# EAGLE design operator-interface-r1 (EAGLE 5.12)
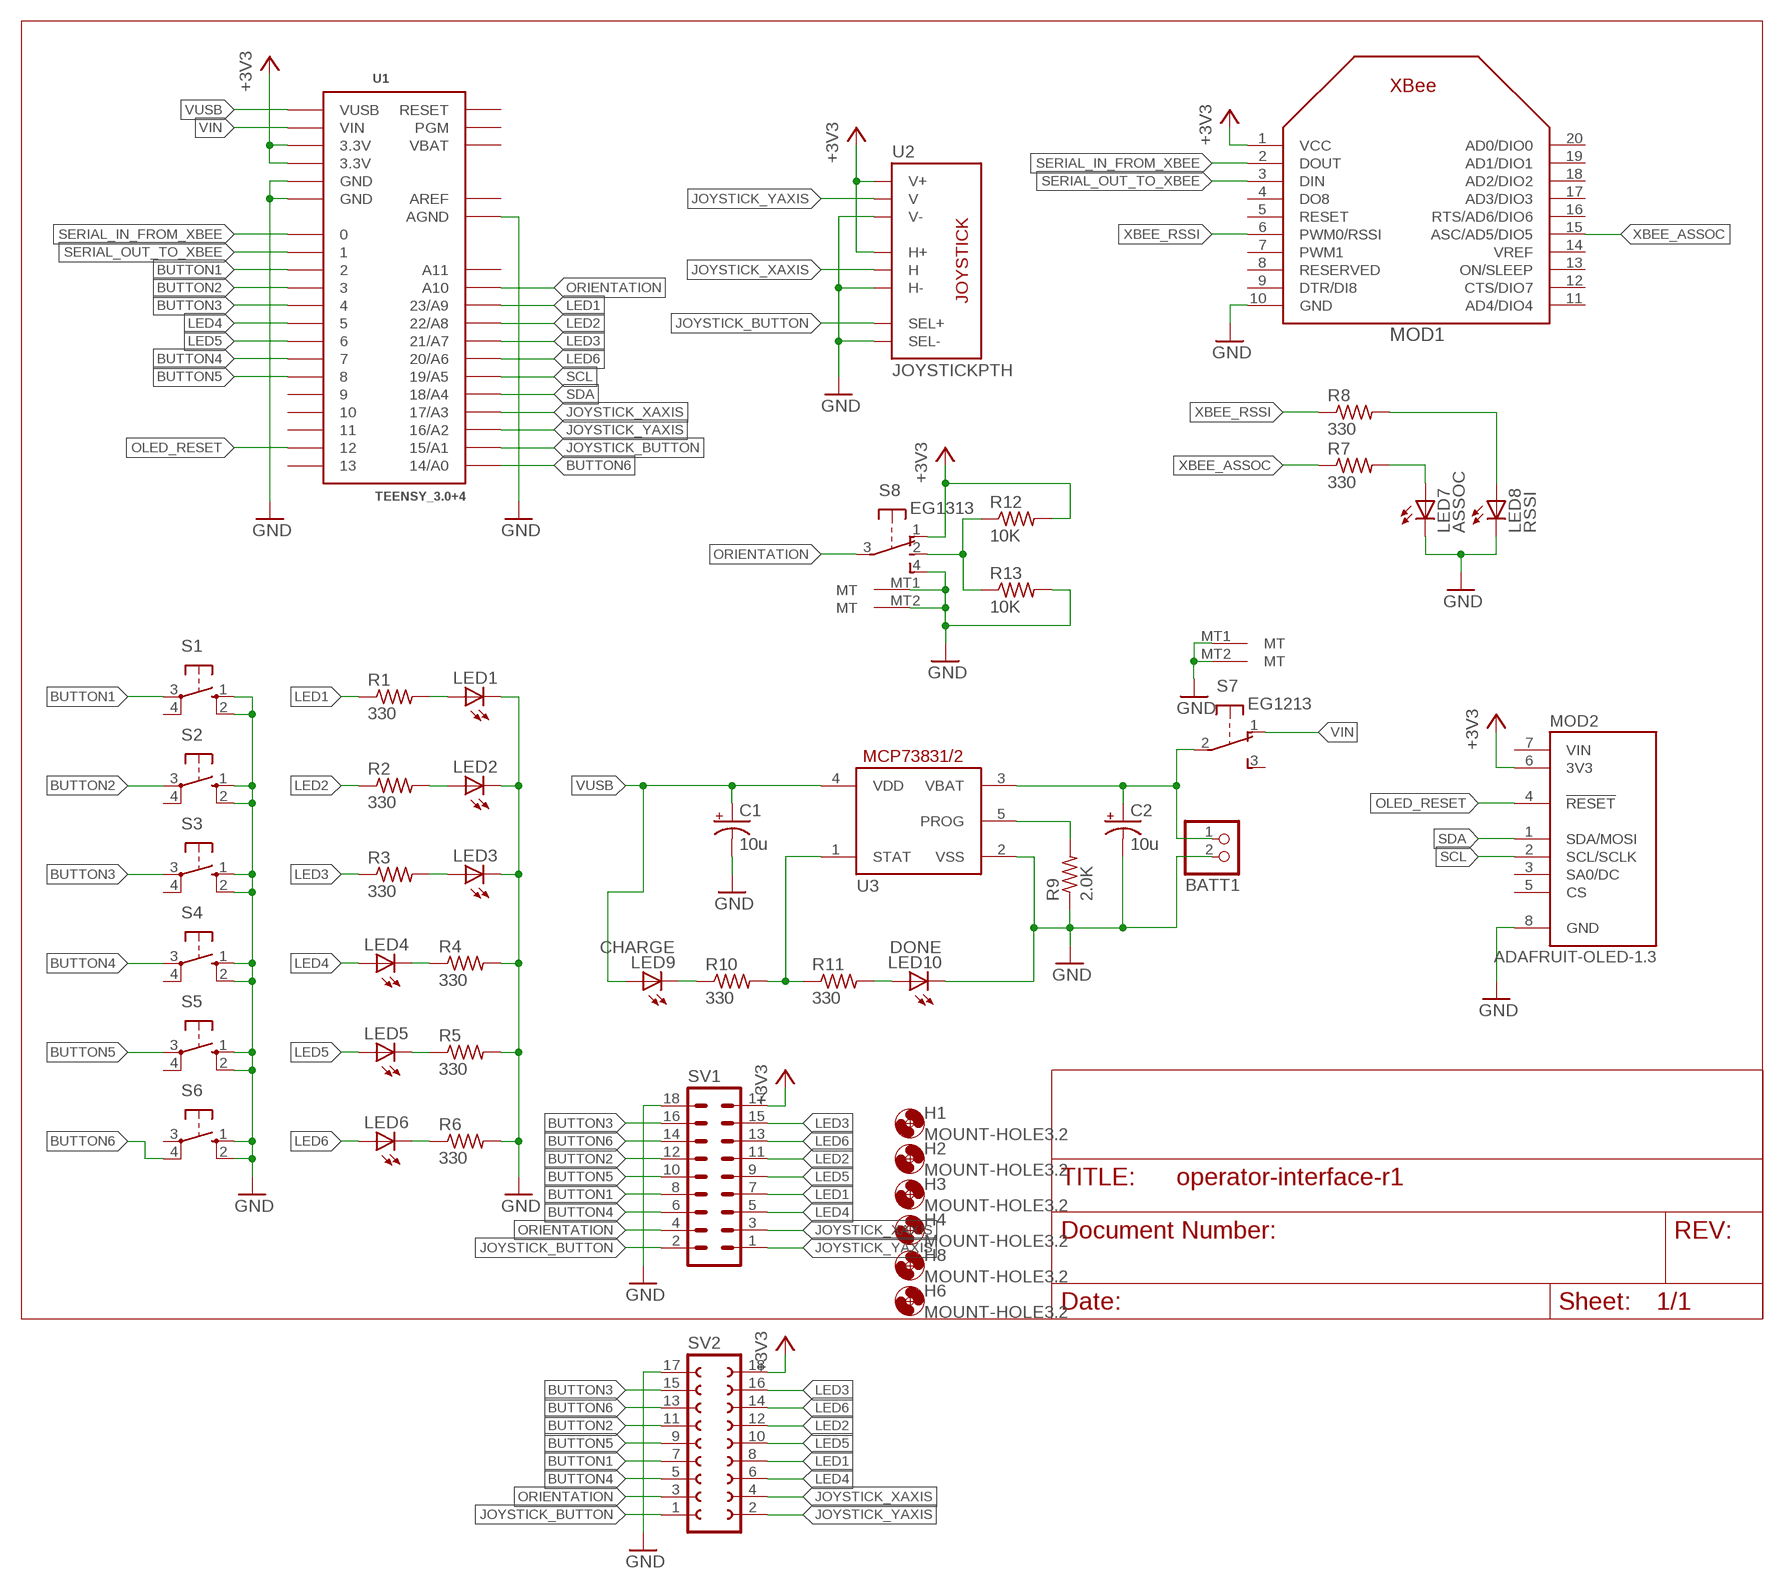
[diagram p0: schematic, sheet 1]

## Parts
BATT1  JST_2PIN-THM  [JST-PH-2-THM]
C1  10u  CPOL-USE2.5-6  [E2,5-6]
C2  10u  CPOL-USE2.5-6  [E2,5-6]
H1  MOUNT-HOLE3.2  [3,2]
H2  MOUNT-HOLE3.2  [3,2]
H3  MOUNT-HOLE3.2  [3,2]
H4  MOUNT-HOLE3.2  [3,2]
H6  MOUNT-HOLE3.2  [3,2]
H8  MOUNT-HOLE3.2  [3,2]
LED1  LED5MM  [LED5MM]
LED2  LED5MM  [LED5MM]
LED3  LED5MM  [LED5MM]
LED4  LED5MM  [LED5MM]
LED5  LED5MM  [LED5MM]
LED6  LED5MM  [LED5MM]
LED7  ASSOC  LED5MM  [LED5MM]
LED8  RSSI  LED5MM  [LED5MM]
LED9  CHARGE  LED5MM  [LED5MM]
LED10  DONE  LED5MM  [LED5MM]
MOD1  XBEE  [XBEE]
MOD2  ADAFRUIT-OLED-1.3  [ADAFRUIT-OLED-1.3]
R1  330  R-US_0207/10  [0207/10]
R2  330  R-US_0207/10  [0207/10]
R3  330  R-US_0207/10  [0207/10]
R4  330  R-US_0207/10  [0207/10]
R5  330  R-US_0207/10  [0207/10]
R6  330  R-US_0207/10  [0207/10]
R7  330  R-US_0207/10  [0207/10]
R8  330  R-US_0207/10  [0207/10]
R9  2.0K  R-US_0207/10  [0207/10]
R10  330  R-US_0207/10  [0207/10]
R11  330  R-US_0207/10  [0207/10]
R12  10K  R-US_0207/10  [0207/10]
R13  10K  R-US_0207/10  [0207/10]
S1  40-XX  [B3F-40XX]
S2  40-XX  [B3F-40XX]
S3  40-XX  [B3F-40XX]
S4  40-XX  [B3F-40XX]
S5  40-XX  [B3F-40XX]
S6  40-XX  [B3F-40XX]
S7  EG1213  [EG1213]
S8  EG1313  [EG1313]
SV1  MA09-2W  [MA09-2W]
SV2  FE09-2W  [FE09-2W]
U1  TEENSY_3.0+4  [TEENSY_3.0+4]
U2  JOYSTICKPTH  [JOYSTICK]
U3  MCP73831/OT  [SOT23-5L]

## Nets
+3V3: MOD1.1(VCC) MOD2.6(3V3) R12.2 S8.1(S1) SV1.17 SV2.18 U1.3.3V U1.3.3V1(3.3V) U2.H1(H+) U2.V1(V+)
BUTTON1: S1.3(P) SV1.8 SV2.7 U1.2
BUTTON2: S2.3(P) SV1.12 SV2.11 U1.3
BUTTON3: S3.3(P) SV1.16 SV2.15 U1.4
BUTTON4: S4.3(P) SV1.6 SV2.5 U1.7
BUTTON5: S5.3(P) SV1.10 SV2.9 U1.8
BUTTON6: S6.4(P1) SV1.14 SV2.13 U1.14/A0
GND: BATT1.2 C1.- C2.- LED1.K(C) LED2.K(C) LED3.K(C) LED7.K(C) LED8.K(C) LED10.K(C) MOD1.10(GND) MOD2.8(GND) R4.2 R5.2 R6.2 R9.1 R13.2 S1.1(S) S1.2(S1) S2.1(S) S2.2(S1) S3.1(S) S3.2(S1) S4.1(S) S4.2(S1) S5.1(S) S5.2(S1) S6.1(S) S6.2(S1) S7.MT1(MT) S7.MT2(MT) S8.4(S3) S8.MT1(MT) S8.MT2(MT) SV1.18 SV2.17 U1.AGND U1.GND U1.GND1(GND) U2.B2A(SEL-) U2.H3(H-) U2.V3(V-) U3.2(VSS)
JOYSTICK_BUTTON: SV1.2 SV2.1 U1.15/A1 U2.B1A(SEL+)
JOYSTICK_XAXIS: SV1.3 SV2.4 U1.17/A3 U2.H2(H)
JOYSTICK_YAXIS: SV1.1 SV2.2 U1.16/A2 U2.V2(V)
LED1: R1.1 SV1.7 SV2.8 U1.23/A9
LED2: R2.1 SV1.11 SV2.12 U1.22/A8
LED3: R3.1 SV1.15 SV2.16 U1.21/A7
LED4: LED4.A SV1.5 SV2.6 U1.5
LED5: LED5.A SV1.9 SV2.10 U1.6
LED6: LED6.A SV1.13 SV2.14 U1.20/A6
N$1: LED8.A R8.2
N$2: LED7.A R7.2
N$3: R12.1 R13.1 S8.2(S2)
N$4: LED1.A R1.2
N$5: LED2.A R2.2
N$6: LED3.A R3.2
N$7: LED4.K(C) R4.1
N$8: LED5.K(C) R5.1
N$9: LED6.K(C) R6.1
N$10: R9.2 U3.5(PROG)
N$11: LED9.K(C) R10.1
N$12: R10.2 R11.1 U3.1(STAT)
N$13: LED10.A R11.2
N$14: BATT1.1 C2.+ S7.2(P) U3.3(VBAT)
OLED_RESET: MOD2.4(!RESET) U1.12
ORIENTATION: S8.3(COM) SV1.4 SV2.3 U1.A10
SCL: MOD2.2(SCL/SCLK) U1.19/A5
SDA: MOD2.1(SDA/MOSI) U1.18/A4
SERIAL_IN_FROM_XBEE: MOD1.2(DOUT) U1.0
SERIAL_OUT_TO_XBEE: MOD1.3(DIN) U1.1
VIN: S7.1(O) U1.VIN
VUSB: C1.+ LED9.A U1.VUSB U3.4(VDD)
XBEE_ASSOC: MOD1.15(ASC/AD5/DIO5) R7.1
XBEE_RSSI: MOD1.6(PWM0/RSSI) R8.1
Unconnected: MOD1.4(DO8) MOD1.5(RESET) MOD1.7(PWM1) MOD1.8(RESERVED) MOD1.9(DTR/DI8) MOD1.11(AD4/DIO4) MOD1.12(CTS/DIO7) MOD1.13(ON/SLEEP) MOD1.14(VREF) MOD1.16(RTS/AD6/DIO6) MOD1.17(AD3/DIO3) MOD1.18(AD2/DIO2) MOD1.19(AD1/DIO1) MOD1.20(AD0/DIO0) MOD2.3(SA0/DC) MOD2.5(CS) MOD2.7(VIN) S1.4(P1) S2.4(P1) S3.4(P1) S4.4(P1) S5.4(P1) S6.3(P) S7.3(S) U1.9 U1.10 U1.11 U1.13 U1.A11 U1.PGM U1.RESET

## Power pins joined to a net without a drawn wire
AREF: U1.AREF
VBAT: U1.VBAT

## Library data of the parts
BATT1 = adafruit:JST_2PIN: JST 2-Pin Connectors of various flavors SMT-RA (S2B-PH-SM4) 4UConnector #17311 SMT (B2B-PH-SM4) THM-RA (S2B-PH) THM (B2B-PH)
C1 C2 = rcl:CPOL-US: POLARIZED CAPACITOR, American symbol
H1-H4 H6 H8 = holes:MOUNT-HOLE: MOUNTING HOLE with drill center marker
LED1-LED10 = led:LED: LED OSRAM: - CHIPLED LG R971, LG N971, LY N971, LG Q971, LY Q971, LO R971, LY R971 LH N974, LH R974 LS Q976, LO Q976, LY Q976 LO Q996 - Hyper CHIPLED LW Q18S LB Q993, LB Q99A, LB R99A - SideLED LS A670, LO A670, LY A670, LG A670, LP A670 LB A673, LV A673, LT A673, LW A673 LH A674 LY A675 LS A676, LA A676, LO A676, LY A676, LW A676 LS A679, LY A679, LG A679 - Hyper Micro SIDELED® LS Y876, LA Y876, LO Y876, LY Y876 LT Y87S - SmartLED LW L88C, LW L88S LB L89C, LB L89S, LG L890 LS L89K, LO L89K, LY L89K LS L896, LA L896, LO L896, LY L896 - TOPLED LS T670, LO T670, LY T670, LG T670, LP T670 LSG T670, LSP T670, LSY T670, LOP T670, LYG T670 LG T671, LOG T671, LSG T671 LB T673, LV T673, LT T673, LW T673 LH T674 LS T676, LA T676, LO T676, LY T676, LB T676, LH T676, LSB T676, LW T676 LB T67C, LV T67C, LT T67C, LS T67K, LO T67K, LY T67K, LW E67C LS E67B, LA E67B, LO E67B, LY E67B, LB E67C, LV E67C, LT E67C LW T67C LS T679, LY T679, LG T679 LS T770, LO T770, LY T770, LG T770, LP T770 LB T773, LV T773, LT T773, LW T773 LH T774 LS E675, LA E675, LY E675, LS T675 LS T776, LA T776, LO T776, LY T776, LB T776 LHGB T686 LT T68C, LB T68C - Hyper Mini TOPLED® LB M676 - Mini TOPLED Santana® LG M470 LS M47K, LO M47K, LY M47K Source: http://www.osram.convergy.de LUXEON: - LUMILED® LXK2-PW12-R00, LXK2-PW12-S00, LXK2-PW14-U00, LXK2-PW14-V00 LXK2-PM12-R00, LXK2-PM12-S00, LXK2-PM14-U00 LXK2-PE12-Q00, LXK2-PE12-R00, LXK2-PE12-S00, LXK2-PE14-T00, LXK2-PE14-U00 LXK2-PB12-K00, LXK2-PB12-L00, LXK2-PB12-M00, LXK2-PB14-N00, LXK2-PB14-P00, LXK2-PB14-Q00 LXK2-PR12-L00, LXK2-PR12-M00, LXK2-PR14-Q00, LXK2-PR14-R00 LXK2-PD12-Q00, LXK2-PD12-R00, LXK2-PD12-S00 LXK2-PH12-R00, LXK2-PH12-S00 LXK2-PL12-P00, LXK2-PL12-Q00, LXK2-PL12-R00 Source: www.luxeon.com KINGBRIGHT: KA-3528ASYC Source: www.kingbright.com
MOD1 = adafruit:XBEE
MOD2 = oled:ADAFRUIT-OLED-1.3
R1-R13 = rcl:R-US_: RESISTOR, American symbol
S1-S6 = switch-omron:40-XX: OMRON SWITCH; MF: OMRON COMPONENTS USA; MPN: B3F-4000; OC_FARNELL: 176434; OC_NEWARK: 36K3105
S7 = oled:EG1213: E-Switch right-angle slide SPDT Part #EG1213 http://www.ladyada.net/library/eagle
S8 = oled:EG1313
SV1 = con-lstb:MA09-2W: PIN HEADER; OC_FARNELL: unknown; OC_NEWARK: unknown
SV2 = con-lsta:FE09-2W: FEMALE HEADER; OC_FARNELL: unknown; OC_NEWARK: unknown
U1 = Teensy3.0-5.12:TEENSY_3.0+4: Teensy 3.0 board, showing all pins that are easily acessible. See 'AllAnalogPins" and 'AllPins' packages for additional pin holes, as needed. The 'Basic' package has fewer pins.
U2 = adafruit:JOYSTICK: Thumb Joystick Joystick commonly found in PS2 controllers. Two pots and a select switch. Adapted from Sparkfun Library (but for more common 6mm switch sticks)
U3 = adafruit:MCP73831: MCP73831/2 Miniature Single-Cell, Fully Integrated Li-Ion, Li-Polymer Charge Management Controllers. Nice and small simple lipoly charge controller, with adjustable current and status output (LED) http://www.ladyada.net/library/pcb/eaglelibrary.html

## Board
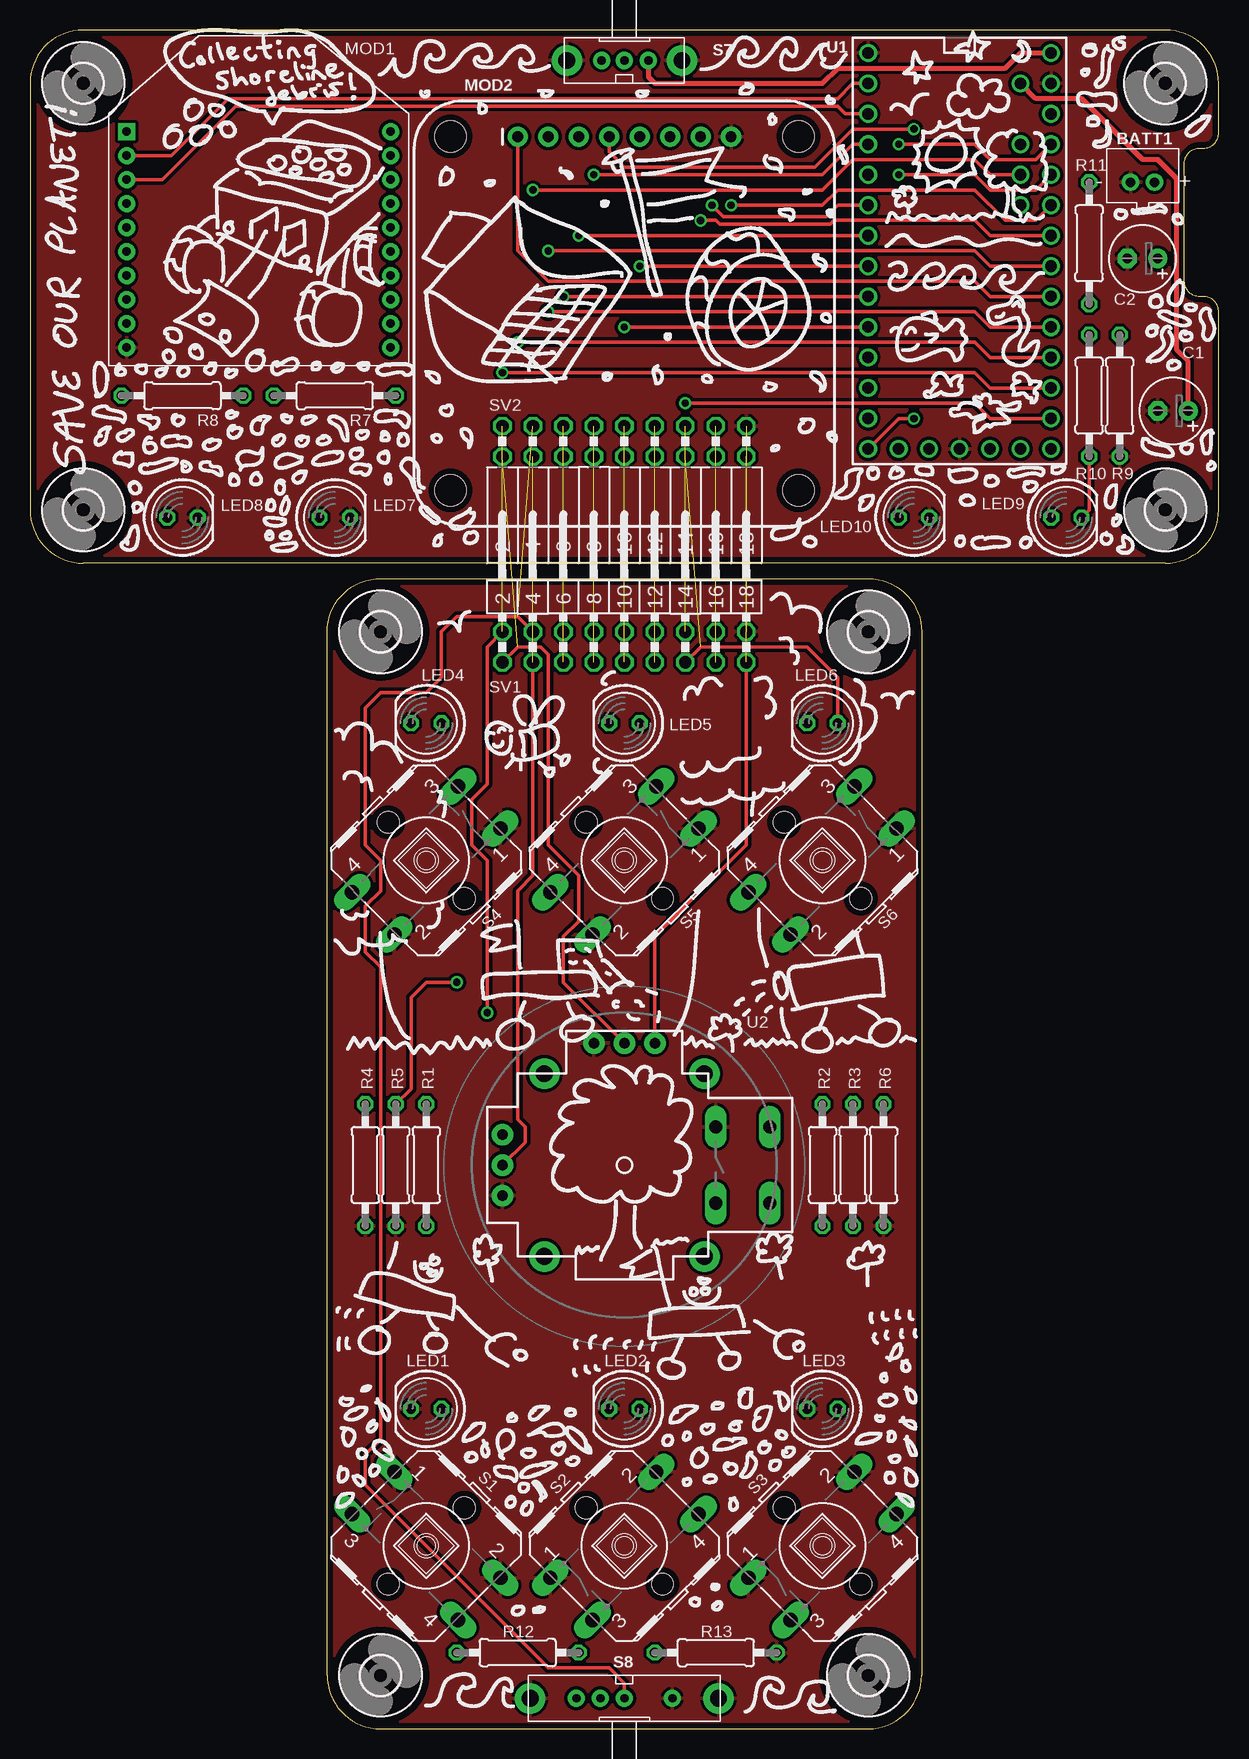
[diagram p1: board, top side]
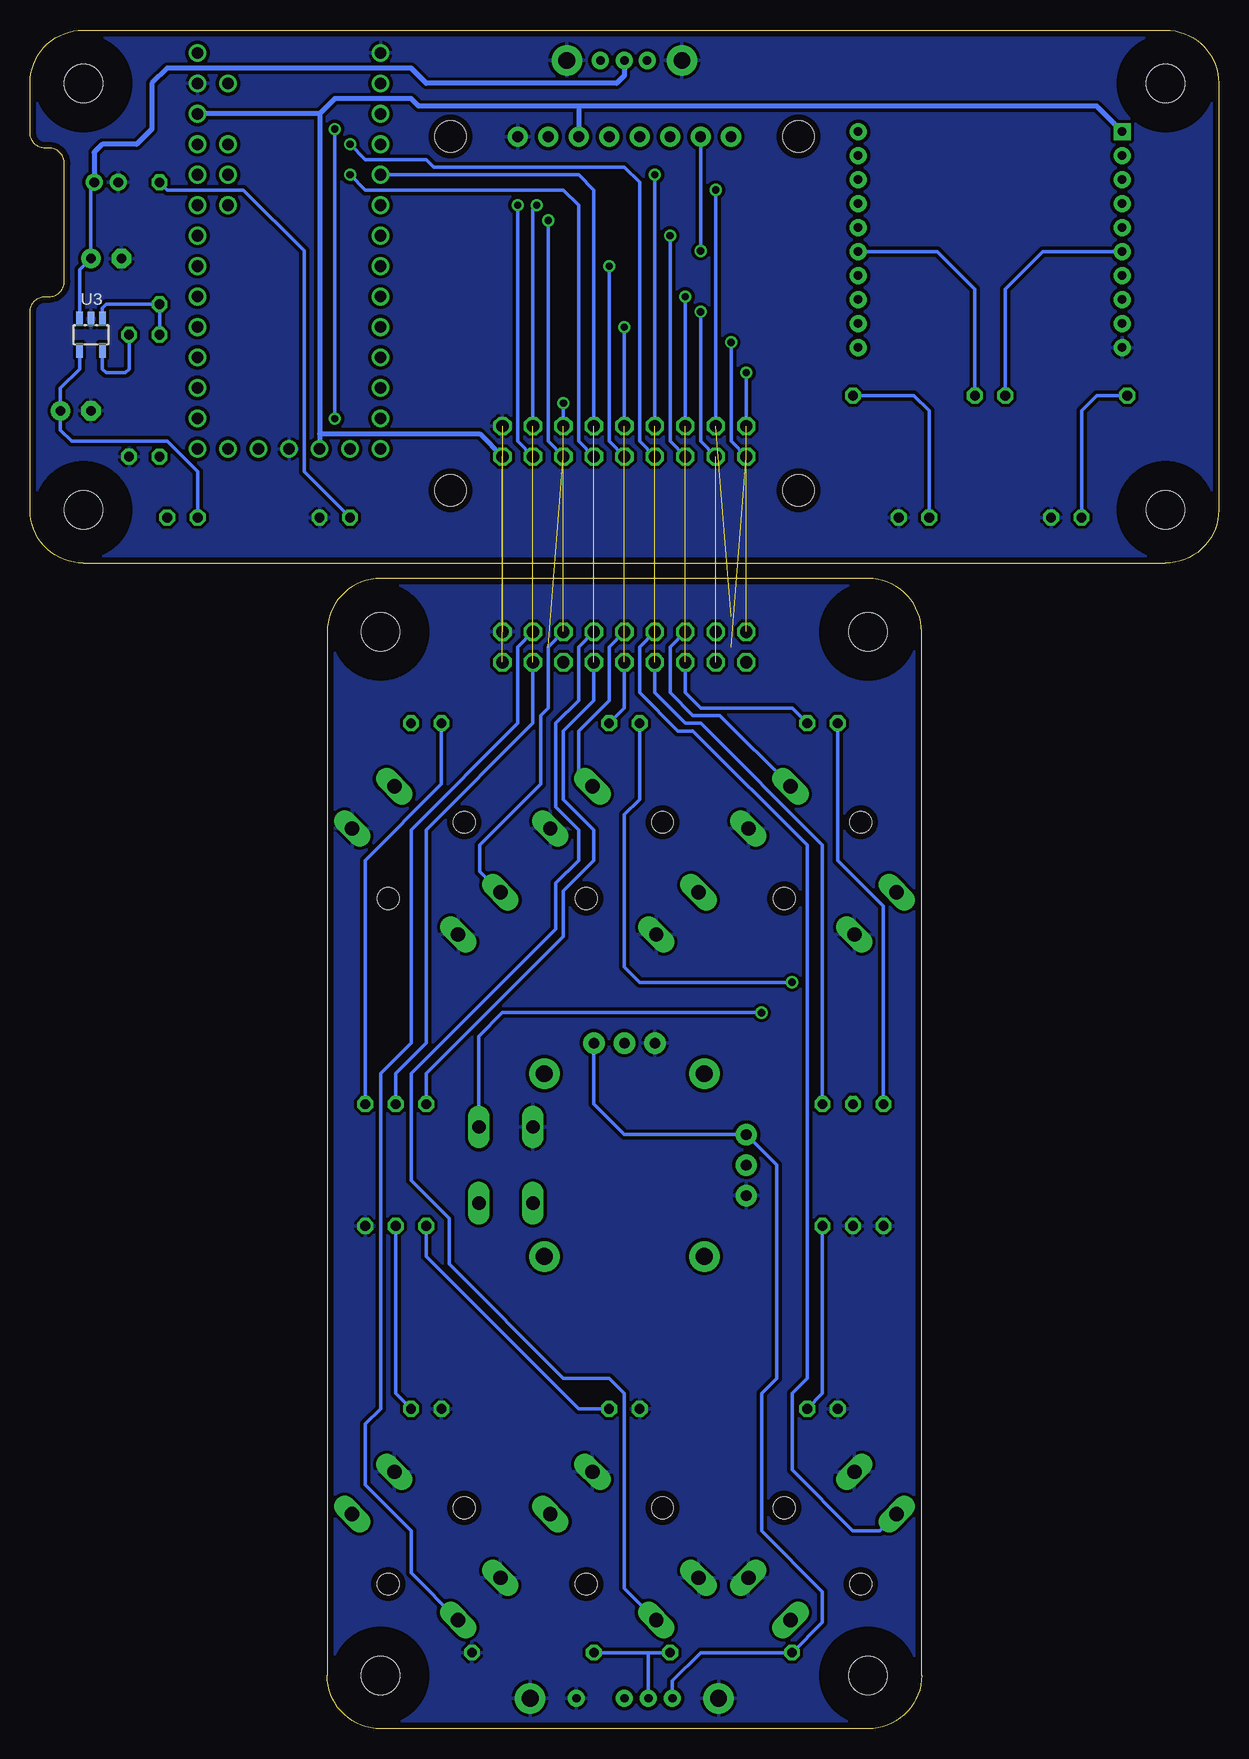
[diagram p2: board, bottom side, seen from below]

Size 99.06 x 141.6 mm. Coordinates in mm from the lower left corner, seen from the top.
Outline: 94.62,97.16 arc90 99.06,101.6 99.06,118.11 arc90 97.79,119.38 97.47,119.38 arc-90 96.2,120.65 96.2,130.49 arc-90 97.47,131.76 97.79,131.76 arc90 99.06,133.03 99.06,137.16 arc90 94.62,141.6 4.45,141.6 arc90 0,137.16 0,101.6 arc90 4.45,97.16 94.62,97.16
Outline: 24.77,4.45 arc90 29.21,0 69.85,0 arc90 74.3,4.45 74.3,91.44 arc90 69.85,95.89 29.21,95.89 arc90 24.77,91.44 24.77,4.45
Copper layers (1*16): Top 0.035mm / dielectric 1.5mm / Bottom 0.035mm
Design rules "default *": minimum track width 10mil, minimum drill 0.5mm, track to track 11mil, track to pad 11mil, pad to pad 11mil, via to via 11mil, smd to smd 11mil, copper to edge 20mil, drill to drill 8mil, minimum pad ring 10mil, minimum via ring 8mil, stop-mask expansion 4mil, vias tented up to drill 0mil, thermal gap 10mil

### Footprints (pad centres in the part's own frame; a part is rotated, then mirrored left to right if it is on the bottom)
JST-PH-2-THM = drill 0.8 pad 1.422 round: 1 1,0; 2 -1,0
E2,5-6 = drill 0.813 pad 1.6 round: + -1.27,0 | drill 0.813 pad 1.6 octagon: - 1.27,0
3,2 = hole 3.2: 0,0
LED5MM = drill 0.813 octagon: A -1.27,0; K 1.27,0
XBEE = drill 0.7 pad 1.422 square: 1 -11,5.5 | drill 0.7 pad 1.422 round: 2 -11,3.5; 3 -11,1.5; 4 -11,-0.5; 5 -11,-2.5; 6 -11,-4.5; 7 -11,-6.5; 8 -11,-8.5; 9 -11,-10.5; 10 -11,-12.5; 11 11,-12.5; 12 11,-10.5; 13 11,-8.5; 14 11,-6.5; 15 11,-4.5; 16 11,-2.5; 17 11,-0.5; 18 11,1.5; 19 11,3.5; 20 11,5.5
ADAFRUIT-OLED-1.3 = drill 0.9 pad 1.676 round: 1 -8.89,0; 2 -6.35,0; 3 -3.81,0; 4 -1.27,0; 5 1.27,0; 6 3.81,0; 7 6.35,0; 8 8.89,0 | hole 2.6: -14.5,0; 14.5,0; -14.5,-29.5; 14.5,-29.5
0207/10 = drill 0.813 octagon: 1 -5.08,0; 2 5.08,0
B3F-40XX = drill 1.194 long: 1 -6.248,2.489; 2 6.248,2.489; 3 -6.248,-2.489; 4 6.248,-2.489 | hole 1.803: 0,-4.496; 0,4.496
EG1213 = drill 0.7 pad 1.422 round: 1 -2,0; 2 0,0; 3 1.9,0 | drill 1.4 pad 2.54 round: MT1 -4.8,0; MT2 4.8,0
EG1313 = drill 0.7 pad 1.422 round: 1 -4,0; 2 -2,0; 3 0,0; 4 4,0 | drill 1.4 pad 2.54 round: MT1 -7.85,0; MT2 7.85,0
MA09-2W = drill 1.016 octagon: 1 -10.16,-1.27; 2 -10.16,1.27; 3 -7.62,-1.27; 4 -7.62,1.27; 5 -5.08,-1.27; 6 -5.08,1.27; 7 -2.54,-1.27; 8 -2.54,1.27; 9 0,-1.27; 10 0,1.27; 11 2.54,-1.27; 12 2.54,1.27; 13 5.08,-1.27; 14 5.08,1.27; 15 7.62,-1.27; 16 7.62,1.27; 17 10.16,-1.27; 18 10.16,1.27
FE09-2W = drill 1.016 octagon: 1 -10.16,1.27; 2 -10.16,-1.27; 3 -7.62,1.27; 4 -7.62,-1.27; 5 -5.08,1.27; 6 -5.08,-1.27; 7 -2.54,1.27; 8 -2.54,-1.27; 9 0,1.27; 10 0,-1.27; 11 2.54,1.27; 12 2.54,-1.27; 13 5.08,1.27; 14 5.08,-1.27; 15 7.62,1.27; 16 7.62,-1.27; 17 10.16,1.27; 18 10.16,-1.27
TEENSY_3.0+4 = drill 0.965 round: 0 -7.62,13.97; 1 -7.62,11.43; 2 -7.62,8.89; 3 -7.62,6.35; 3.3V 7.62,11.43; 3.3V1 -2.54,-16.51; 4 -7.62,3.81; 5 -7.62,1.27; 6 -7.62,-1.27; 7 -7.62,-3.81; 8 -7.62,-6.35; 9 -7.62,-8.89; 10 -7.62,-11.43; 11 -7.62,-13.97; 12 -7.62,-16.51; 13 7.62,-16.51; 14/A0 7.62,-13.97; 15/A1 7.62,-11.43; 16/A2 7.62,-8.89; 17/A3 7.62,-6.35; 18/A4 7.62,-3.81; 19/A5 7.62,-1.27; 20/A6 7.62,1.27; 21/A7 7.62,3.81; 22/A8 7.62,6.35; 23/A9 7.62,8.89; A10 5.08,6.35; A11 5.08,3.81; AGND 7.62,13.97; AREF 5.08,8.89; GND -7.62,16.51; GND1 0,-16.51; PGM 2.54,-16.51; RESET 5.08,-16.51; VBAT -5.08,-16.51; VIN 7.62,16.51; VUSB 5.08,13.97
JOYSTICK = drill 1.1 pad 1.778 long: B1A -3.175,12.12; B1B 3.175,12.12; B2A -3.175,7.62; B2B 3.175,7.62 | drill 0.889 pad 1.778 round: H1 -2.54,-10.16; H2 0,-10.16; H3 2.54,-10.16; V1 -10.16,2.54; V2 -10.16,0; V3 -10.16,-2.54 | drill 1.397 pad 2.54 round: MOUNT1 -7.62,6.668; MOUNT2 -7.62,-6.668; MOUNT3 7.62,-6.668; MOUNT4 7.62,6.668
SOT23-5L = smd 0.55 x 1.2: 1 -0.95,-1.3; 2 0,-1.3; 3 0.95,-1.3; 4 0.95,1.3; 5 -0.95,1.3

### Placement (x,y rotation side)
BATT1  92.71,128.91 0 top
C1  95.25,109.86 180 top
C2  92.71,122.56 180 top
H1  4.45,137.16 0 top
H2  94.62,137.16 0 top
H3  94.62,101.6 0 top
H4  4.45,101.6 0 top
H5  MOUNT-HOLE3.2  [3,2]  29.21,4.45 0 top
H6  69.85,4.45 0 top
H7  MOUNT-HOLE3.2  [3,2]  29.21,91.44 0 top
H8  69.85,91.44 0 top
LED1  33.02,26.67 180 top
LED2  49.53,26.67 180 top
LED3  66.04,26.67 180 top
LED4  33.02,83.82 180 top
LED5  49.53,83.82 180 top
LED6  66.04,83.82 180 top
LED7  25.4,100.97 0 top
LED8  12.7,100.97 0 top
LED9  86.36,100.97 0 top
LED10  73.66,100.97 0 top
MOD1  19.05,127.64 0 top
MOD2  49.53,132.72 0 top
R1  33.02,46.99 270 top
R2  66.04,46.99 270 top
R3  68.58,46.99 270 top
R4  27.94,46.99 270 top
R5  30.48,46.99 270 top
R6  71.12,46.99 270 top
R7  25.4,111.12 0 top
R8  12.7,111.12 180 top
R9  90.81,111.12 90 top
R10  88.27,111.12 90 top
R11  88.27,123.83 90 top
R12  40.64,6.35 180 top
R13  57.15,6.35 0 top
S1  33.02,15.24 315 top
S2  49.53,15.24 45 top
S3  66.04,15.24 45 top
S4  33.02,72.39 225 top
S5  49.53,72.39 225 top
S6  66.04,72.39 225 top
S7  49.53,139.06 180 top
S8  49.53,2.54 0 top
SV1  49.53,90.17 0 top
SV2  49.53,107.31 0 top
U1  77.47,123.19 0 top
U2  49.53,46.99 270 top
U3  93.98,116.2 180 bottom
U$1  [TOP-ART]  1.27,1.27 0 top

### Tracks (layer width: path | path; a pad name or v marks a point on that pad's centre or on a via)
+3V3  (1 unrouted)
  Top 0.305: SV1.17 59.69,73.66 52.07,66.04 U2.V1
  Bottom 0.305: S8.1 45.53,4 43.18,6.35 R12.2 33.02,8.89 33.02,11.43 38.1,16.51 38.1,27.94 36.83,29.21 36.83,46.99 U2.H1 49.53,49.53 52.07,52.07 U2.V1
  Bottom 0.406: SV2.18 61.59,107.95 74.93,107.95 | 74.93,107.95 U1.3.3V1 | 74.93,134.62 U1.3.3V | 53.34,135.25 66.67,135.25 67.31,135.89 73.66,135.89 74.93,134.62 | 53.34,135.25 MOD2.6 | MOD1.1 8.05,133.15 10.16,135.25 53.34,135.25 | 74.93,134.62 74.93,107.95
BUTTON1  (via drill 0.6)  (1 unrouted)
  Top 0.305: v46.99,129.54 66.04,129.54 68.58,132.08 U1.2
  Bottom 0.305: SV1.8 48.26,90.17 48.26,86.36 45.09,83.19 43.81,83.19 34.29,73.66 34.29,29.21 35.56,27.94 35.56,21.59 30.48,16.51 28.23,16.51 S1.3 | SV2.7 v46.99,129.54
BUTTON2  (1 unrouted)
  Bottom 0.305: SV1.12 53.34,90.17 53.34,85.72 55.25,83.82 55.25,76.83 53.34,74.93 53.34,72.39 55.25,70.48 55.25,66.67 67.31,54.61 67.31,45.72 64.14,42.55 64.14,38.73 54.61,29.21 50.8,29.21 49.53,27.94 49.53,11.72 S2.3 | SV2.11 52.07,128.27 53.34,129.54 U1.3
BUTTON3  (via drill 0.6)  (1 unrouted)
  Top 0.305: v56.83,127 57.79,126.05 66.36,126.05 67.31,127 U1.4
  Bottom 0.305: SV2.15 57.15,126.68 v56.83,127 | S3.3 67.31,12.99 67.31,16.51 71.12,20.32 71.12,25.4 69.85,26.67 69.85,54.61 67.31,57.15 67.31,74.93 58.42,83.82 58.42,90.17 SV1.16
BUTTON4  (via drill 0.6)  (1 unrouted)
  Top 0.305: v44.45,119.38 U1.7
  Bottom 0.305: SV1.6 45.72,90.17 45.72,86.36 43.81,84.45 41.56,84.45 S4.3 | SV2.5 v44.45,119.38
BUTTON5  (via drill 0.6)  (1 unrouted)
  Top 0.305: v49.53,116.84 U1.8
  Bottom 0.305: SV1.10 50.8,90.17 50.8,85.72 53.34,83.19 53.34,79.72 S5.3 | SV2.9 v49.53,116.84
BUTTON6  (via drill 0.6)  (1 unrouted)
  Top 0.305: v54.61,110.49 78.74,110.49 80.01,109.22 U1.14/A0
  Bottom 0.305: SV1.14 55.88,90.17 55.88,85.09 56.52,84.45 56.52,78.74 61.59,73.66 61.59,71.47 S6.4 | SV2.13 v54.61,110.49
GND  (1 unrouted)
  pour Bottom: -1.27,141.6 -1.27,97.16 100.33,97.16 100.33,141.6
  pour Top: -1.27,141.6 -1.27,97.16 100.33,97.16 100.33,141.6
  pour Top: 24.77,95.89 24.77,0 74.3,0 74.3,95.89
  pour Bottom: 24.77,95.89 24.77,0 74.3,0 74.3,95.89
JOYSTICK_BUTTON  (via drill 0.6)  (1 unrouted)
  Top 0.305: v39.37,113.03 78.74,113.03 80.01,111.76 U1.15/A1 | SV1.2 38.1,90.17 38.1,78.74 36.83,77.47 36.83,73.66 38.1,72.39 v38.1,59.69
  Bottom 0.305: SV2.1 v39.37,113.03 | v38.1,59.69 59.69,59.69 61.65,57.73 U2.B1A
JOYSTICK_XAXIS  (via drill 0.6)  (1 unrouted)
  Top 0.305: U1.17/A3 80.01,116.84 78.74,118.11 v43.18,118.11 | SV1.3 41.91,71.12 40.64,69.85 40.64,50.8 41.27,50.16 41.27,48.9 U2.H2
  Bottom 0.305: v43.18,118.11 43.18,107.31 SV2.4
JOYSTICK_YAXIS  (via drill 0.6)  (1 unrouted)
  Top 0.305: U1.16/A2 80.01,114.3 78.74,115.57 v40.64,115.57 | SV1.1 40.64,90.17 42.55,90.17 43.18,89.53 43.18,73.66 45.72,71.12 45.72,67.31 44.45,66.04 44.45,62.23 U2.V2
  Bottom 0.305: v40.64,115.57 40.64,107.31 SV2.2
LED1  (via drill 0.6)  (1 unrouted)
  Top 0.305: U1.23/A9 83.82,130.81 80.01,130.81 78.74,132.08 v72.39,132.08
  Bottom 0.305: SV1.7 46.99,86.36 44.45,83.82 43.18,83.82 33.02,73.66 R1.1 | SV2.8 48.26,107.31 48.26,128.91 49.53,130.18 65.41,130.18 66.04,130.81 71.12,130.81 v72.39,132.08
LED2  (via drill 0.6)  (1 unrouted)
  Top 0.305: U1.22/A8 83.82,128.27 80.01,128.27 78.74,129.54 v72.39,129.54
  Bottom 0.305: SV1.11 52.07,85.72 54.61,83.19 54.61,77.47 52.07,74.93 52.07,72.39 54.61,69.85 54.61,66.04 66.04,54.61 R2.1 | SV2.12 53.34,107.31 53.34,127 54.61,128.27 71.12,128.27 v72.39,129.54
LED3  (via drill 0.6)  (1 unrouted)
  Top 0.305: v58.42,127 66.04,127 67.31,128.27 78.74,128.27 81.28,125.73 83.82,125.73 U1.21/A7
  Bottom 0.305: SV1.15 57.15,83.82 66.04,74.93 66.04,57.15 68.58,54.61 R3.1 | SV2.16 58.42,107.31 v58.42,127
LED4  (via drill 0.6)  (1 unrouted)
  Top 0.305: v45.72,124.46 U1.5
  Bottom 0.305: SV1.5 44.45,86.36 43.18,85.09 35.56,85.09 LED4.A | SV2.6 45.72,107.31 v45.72,124.46
LED5  (via drill 0.6)  (1 unrouted)
  Top 0.305: v50.8,121.92 U1.6
  Bottom 0.305: SV1.9 49.53,85.09 LED5.A | SV2.10 50.8,107.31 v50.8,121.92
LED6  (via drill 0.6)  (1 unrouted)
  Top 0.305: SV1.13 55.88,90.17 64.77,90.17 67.31,87.63 LED6.A | v55.88,125.73 57.15,125.73 57.47,125.41 66.67,125.41 66.99,125.73 78.74,125.73 80.01,124.46 U1.20/A6
  Bottom 0.305: SV2.14 55.88,107.31 v55.88,125.73
N$1
  Bottom 0.305: LED8.A 11.43,109.86 10.16,111.12 R8.2
N$2
  Bottom 0.305: LED7.A 24.13,109.86 25.4,111.12 R7.2
N$3
  Bottom 0.305: S8.2 47.53,6.25 47.62,6.35 | R12.1 47.62,6.35 | 47.62,6.35 R13.1
N$4
  Bottom 0.305: R1.2 33.02,27.94 LED1.A
N$5
  Bottom 0.305: R2.2 66.04,39.37 53.34,26.67 LED2.A
N$6
  Bottom 0.305: R3.2 68.58,27.94 LED3.A
N$7
  Bottom 0.305: LED4.K 31.75,72.39 27.94,68.58 R4.1
N$8  (via drill 0.6)
  Top 0.305: R5.1 31.75,53.34 31.75,60.96 33.02,62.23 v35.56,62.23
  Bottom 0.305: v35.56,62.23 48.26,62.23 49.53,63.5 49.53,76.2 48.26,77.47 LED5.K
N$9
  Bottom 0.305: LED6.K 64.77,78.74 71.12,72.39 R6.1
N$10
  Bottom 0.305: U3.5 93.03,113.35 92.71,113.03 91.12,113.03 90.81,113.35 R9.2
N$11
  Top 0.305: R10.1 88.27,101.6 LED9.K
N$12
  Bottom 0.305: U3.1 93.03,118.42 92.71,118.75 R11.1 R10.2
N$13
  Bottom 0.305: R11.2 87.63,128.27 81.28,128.27 76.2,123.19 76.2,104.78 LED10.A
N$14
  Bottom 0.305: U3.3 94.93,121.61 C2.+ 93.98,128.63 BATT1.1
  Bottom 0.406: S7.2 49.53,137.79 50.16,137.16 66.04,137.16 67.31,138.43 87.63,138.43 88.9,137.16 88.9,133.35 90.17,132.08 93.03,132.08 93.71,131.4 BATT1.1
OLED_RESET  (via drill 0.6)
  Top 0.305: MOD2.4 48.26,131.44 49.53,130.18 65.41,130.18 68.58,133.35 v73.66,133.35 | v73.66,109.22 72.39,109.22 U1.12
  Bottom 0.305: v73.66,109.22 v73.66,133.35
ORIENTATION  (via drill 0.6)  (1 unrouted)
  Top 0.305: v41.91,128.27 66.04,128.27 68.58,130.81 78.74,130.81 80.01,129.54 U1.A10 | SV1.4 40.64,92.71 35.56,92.71 34.29,91.44 34.29,87.63 33.02,86.36 29.21,86.36 27.94,85.09 27.94,73.66 29.21,72.39 29.21,69.85 27.94,68.58 27.94,64.77 29.21,63.5 29.21,24.13 27.94,22.86 27.94,20.32 43.18,5.08 48.26,5.08 49.53,3.81 S8.3
  Bottom 0.305: SV2.3 v41.91,128.27
SCL  (via drill 0.6)
  Top 0.305: U1.19/A5 80.01,121.92 78.74,123.19 v43.18,123.19
  Bottom 0.305: v43.18,123.19 MOD2.2
SDA
  Top 0.305: U1.18/A4 80.01,119.38 78.74,120.65 43.18,120.65 40.64,123.19 MOD2.1
SERIAL_IN_FROM_XBEE
  Top 0.305: U1.0 68.58,137.16 67.31,135.89 16.51,135.89 11.76,131.13 MOD1.2
SERIAL_OUT_TO_XBEE
  Top 0.305: MOD1.3 11.02,129.13 17.15,135.25 67.31,135.25 67.94,134.62 U1.1
VIN
  Top 0.406: S7.1 51.53,137.7 52.07,137.16 66.04,137.16 67.31,138.43 81.28,138.43 82.55,139.7 U1.VIN
VUSB
  Top 0.406: U1.VUSB 83.82,135.89 87.63,135.89 92.71,130.81 93.98,130.81 95.57,129.22 95.57,114.94 96.52,113.98 C1.+
  Bottom 0.305: LED9.A 85.09,104.78 87.63,107.31 95.57,107.31 96.52,108.27 C1.+ 96.52,111.76 94.93,113.35 U3.4
XBEE_ASSOC
  Bottom 0.305: MOD1.15 23.44,123.14 20.32,120.02 R7.1
XBEE_RSSI
  Bottom 0.305: MOD1.6 14.66,123.14 17.78,120.02 R8.1